# EAGLE schematic cme_schematic (EAGLE 9.2.2)
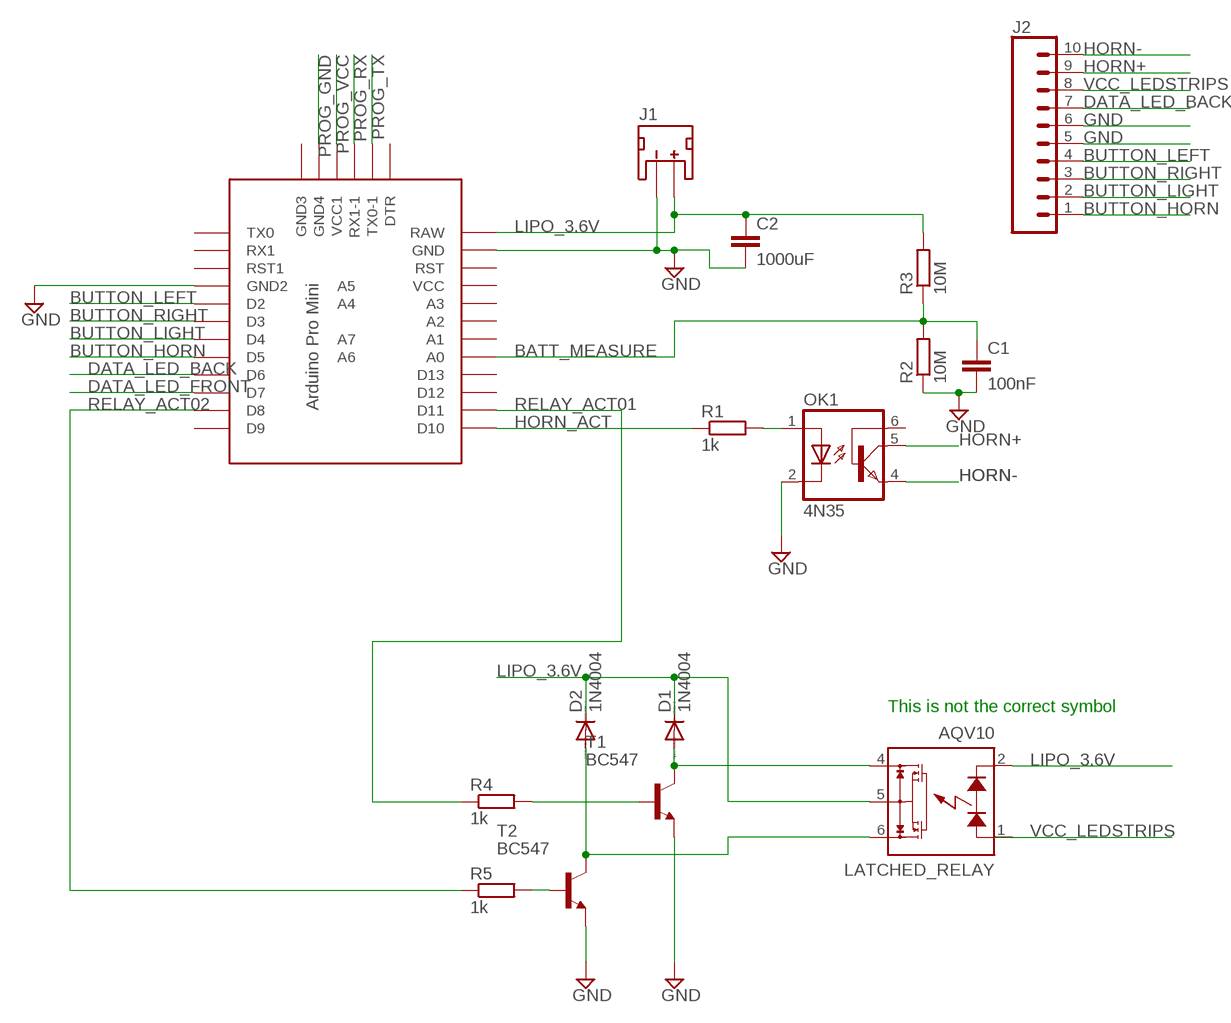
[diagram p0: schematic, sheet 1]

## Parts
C1  100nF  C-EU025-025X050  [C025-025X050]
C2  1000uF  C-EU025-025X050  [C025-025X050]
D1  1N4004  [DO41-10]
D2  1N4004  [DO41-10]
J1  JST_2MM_MALE  [JST-2-SMD]
J2  CONN_10"  [1X10]
LATCHED_RELAY  AQV10  [DIL06]
OK1  4N35  [DIL06]
R1  1k  R-EU_0617/22  [0617/22]
R2  10M  R-EU_0617/22  [0617/22]
R3  10M  R-EU_0617/22  [0617/22]
R4  1k  R-EU_0617/22  [0617/22]
R5  1k  R-EU_0617/22  [0617/22]
T1  BC547  [TO92]
T2  BC547  [TO92]
U$1  PRO-MINI-2  [PRO-MINI-2]

## Nets
BATT_MEASURE: C1.1 R2.2 R3.1 U$1.A0
BUTTON_HORN: J2.1 U$1.D5
BUTTON_LEFT: J2.4 U$1.D2
BUTTON_LIGHT: J2.2 U$1.D4
BUTTON_RIGHT: J2.3 U$1.D3
DATA_LED_BACK: J2.7 U$1.D6
DATA_LED_FRONT: U$1.D7
GND: C1.2 C2.2 J1.1(-) J2.5 J2.6 OK1.2(C) R2.1 T1.1(E) T2.1(E) U$1.GND U$1.GND1(GND2)
HORN+: OK1.5(COL)
HORN-: OK1.4(EMI)
HORN_ACT: R1.1 U$1.D10
LIPO_3.6V: C2.1 D1.C D2.C J1.2(+) LATCHED_RELAY.2(K) LATCHED_RELAY.5(S) R3.2 U$1.RAW
N$1: OK1.1(A) R1.2
N$2: D1.A LATCHED_RELAY.4(D2) T1.3(C)
N$3: D2.A LATCHED_RELAY.6(D1) T2.3(C)
N$5: R5.2 T2.2(B)
N$6: R4.2 T1.2(B)
N$14: J2.9
N$15: J2.10
PROG_GND: U$1.GND3(GND4)
PROG_RX: U$1.RX1-1
PROG_TX: U$1.TX0-1
PROG_VCC: U$1.VCC1
RELAY_ACT01: R4.1 U$1.D11
RELAY_ACT02: R5.1 U$1.D8
VCC_LEDSTRIPS: J2.8 LATCHED_RELAY.1(A)
Unconnected: J1.NC1(PAD1) J1.NC2(PAD2) OK1.6(BAS) U$1.A1 U$1.A2 U$1.A3 U$1.A4 U$1.A5 U$1.A6 U$1.A7 U$1.D9 U$1.D12 U$1.D13 U$1.DTR U$1.GND2(GND3) U$1.RST U$1.RST1 U$1.RX1 U$1.TX0 U$1.VCC

## Notes on the sheet
- This is not the correct symbol

## Library data of the parts
C1 C2 = rcl:C-EU: CAPACITOR, European symbol; SPICEPREFIX: C
D1 D2 = diode:1N4004: DIODE general purpose rectifier, 1 A
J1 = SparkFun-Connectors:JST_2MM_MALE: JST 2MM MALE RA CONNECTOR Two pin, compact surface mount connector. Commonly used as a battery input connection point. We really like the solid locking feeling and high current rating on these small connectors. We use these all the time as battery connectors. Mates to single-cell LiPo batteries. Here is the connector we sell at SparkFun: JST Right Angle Connector - White <https://www.sparkfun.com/products/8612> (PRT-08612) Datasheet <http://www.sparkfun.com/datasheets/Prototyping/Connectors/JST-Horizontal.pdf> It was used on these SparkFun products: SparkFun MOSFET Power Controller <https://www.sparkfun.com/products/11214> (PRT-11214) SparkFun Battery Babysitter - LiPo Battery Manager <https://www.sparkfun.com/products/13777> (PRT-13777) And many, many others that required a lipo battery connection.; PROD_ID: CONN-11443; SF_ID: PRT-08612
J2 = SparkFun-Connectors:CONN_10: Multi connection point. Often used as Generic Header-pin footprint for 0.1 inch spaced/style header connections On any of the 0.1 inch spaced packages, you can populate with these: Break Away Headers - Straight <https://www.sparkfun.com/products/116> (PRT-00116) Break Away Male Headers - Right Angle <https://www.sparkfun.com/products/553> (PRT-00553) Female Headers <https://www.sparkfun.com/products/115> (PRT-00115) Break Away Headers - Machine Pin <https://www.sparkfun.com/products/117> (PRT-00117) Break Away Female Headers - Swiss Machine Pin <https://www.sparkfun.com/products/743> (PRT-00743) Arduino Stackable Header - 10 Pin <https://www.sparkfun.com/products/11376> (PRT-11376) For SCREWTERMINALS and SPRING TERMINALS visit here: Screw Terimnals on SparkFun.com <https://www.sparkfun.com/search/results?term=Screw+Terminals> (5mm/3.5mm/2.54mm spacing) This device is also useful as a general connection point to wire up your design to another part of your project. Our various solder wires solder well into these plated through hole pads. Hook-Up Wire - Assortment (Stranded, 22 AWG) <https://www.sparkfun.com/products/11375> (PRT-11375) Hook-Up Wire - Assortment (Solid Core, 22 AWG) <https://www.sparkfun.com/products/11367> (PRT-11367) View the entire wire category on our website here <https://www.sparkfun.com/categories/141> Special notes: Molex polarized connector foot print use with SKU : PRT-08231 with associated crimp pins and housings. 1MM SMD Version SKU: PRT-10208 NOTES ON THE VARIANTS LOCK and LOCK_LONGPADS... This footprint was designed to help hold the alignment of a through-hole component (i.e. 6-pin header) while soldering it into place. You may notice that each hole has been shifted either up or down by 0.005 of an inch from it's more standard position (which is a perfectly straight line). This slight alteration caused the pins (the squares in the middle) to touch the edges of the holes. Because they are alternating, it causes a "brace" to hold the component in place. 0.005 has proven to be the perfect amount of "off-center" position when using our standard breakaway headers. Although looks a little odd when you look at the bare footprint, once you have a header in there, the alteration is very hard to notice. Also,if you push a header all the way into place, it is covered up entirely on the bottom side.; PROD_ID: CONN-11563
LATCHED_RELAY = relay:AQV*: PhotoMOS Relay NAiS Source: Data sheet <http://www.panasonic-electric-works.com/catalogues/downloads/photomos/ds_x615_en_aqv10_20.pdf>; MF: AROMAT/ MATSUSHITA; MPN: AQV102; OC_FARNELL: 2006029; OC_NEWARK: 94F8718
OK1 = optocoupler:4N35: MOTOROLA OPTO COUPLER; MF: FAIRCHILD SEMICONDUCTOR; MPN: 4N35; OC_FARNELL: 1328375; OC_NEWARK: 72K9946
R1-R5 = rcl:R-EU_: RESISTOR, European symbol; SPICEPREFIX: R
T1 T2 = transistor:BC547: NPN TRANSISTOR
U$1 = Arduino-clone:PRO-MINI-2: Arduino Pro Mini Layout 2 Sparkfun.com